# Altium schematic sheet 05021002_GPIO's.SchDoc: Ipê Board
size A4; Organization: Cerebra SC; Address1: R. Coriolano José Gilbertone; Address2: Jd. Paulista; Address3: n° 703; Address4: São Carlos - Brasil; DocumentNumber: 3; Revision: A; SheetNumber: 3; SheetTotal: 8
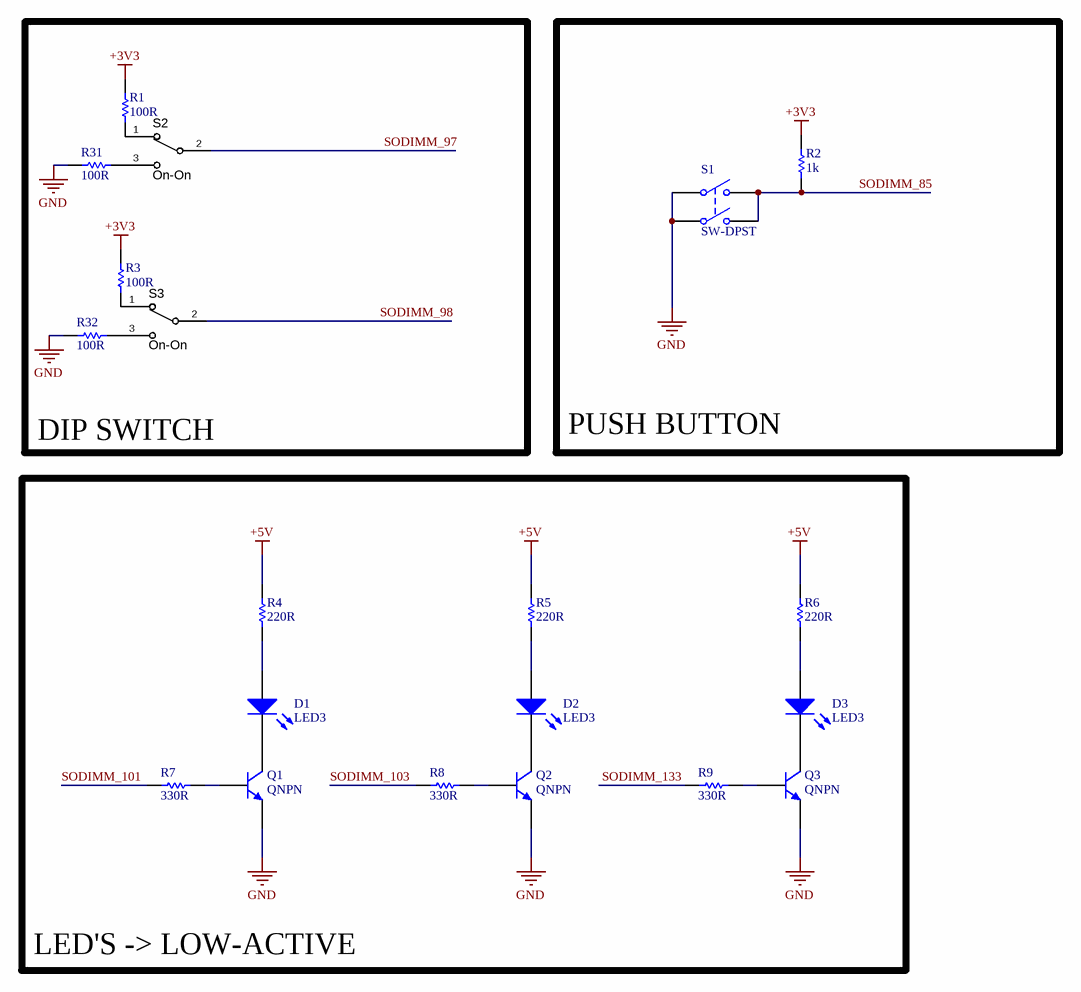
[diagram p0: 05021002_GPIO's.SchDoc]

## Parts
D1  LED3  [LED-0805-K]
D2  LED3  [LED-0805-K]
D3  LED3  [LED-0805-K]
Q1  QNPN  [SOT-23]
Q2  QNPN  [SOT-23]
Q3  QNPN  [SOT-23]
R1  100R  [0805]
R2  1k  [0805]
R3  100R  [0805]
R4  220R  [0805]
R5  220R  [0805]
R6  220R  [0805]
R7  330R  [0805]
R8  330R  [0805]
R9  330R  [0805]
R31  100R  [0805]
R32  100R  [0805]
S1  SW-DPST  [430182080816]
S2  ON-ON  [SWITCH_SPDT_SLIDER]
S3  ON-ON  [SWITCH_SPDT_SLIDER]

## Blocks framed on the sheet
DIP SWITCH: R1 R3 R31 R32 S2 S3
PUSH BUTTON: R2 S1
LED'S -> LOW-ACTIVE: D1-D3 Q1-Q3 R4-R9

## Nets
+3V3: R1.2 R2.2 R3.2
+5V: R4.2 R5.2 R6.2
GND: Q1.3(E) Q2.3(E) Q3.3(E) R31.2 R32.2 S1.1(COMMON1) S1.3(COMMON2)
SODIMM_85: R2.1 S1.2(NO1) S1.4(NO2)
SODIMM_97: S2.2
SODIMM_98: S3.2
SODIMM_101: R7.1
SODIMM_103: R8.1
SODIMM_133: R9.1
NetD1_1: D1.1(A) R4.1
NetD1_2: D1.2(K) Q1.1(C)
NetD2_1: D2.1(A) R5.1
NetD2_2: D2.2(K) Q2.1(C)
NetD3_1: D3.1(A) R6.1
NetD3_2: D3.2(K) Q3.1(C)
NetQ1_2: Q1.2(B) R7.2
NetQ2_2: Q2.2(B) R8.2
NetQ3_2: Q3.2(B) R9.2
NetR1_1: R1.1 S2.1
NetR3_1: R3.1 S3.1
NetR31_1: R31.1 S2.3
NetR32_1: R32.1 S3.3

## Notes on the sheet
- Title
- Size:
- Date:
- A4
- Number:
- Time:
- Revision:
- Sheet
- of
- File:

## Library data of the parts
D1-D3 = LED3: Typical BLUE SiC LED; pin to pad: 1>A 2>K; Part Number 1: LG R971-KN-1; Manufacturer 1: OSRAM Opto Semiconductors Inc.; Published: 8-Jun-2000; LatestRevisionDate: 17-Dec-2003; LatestRevisionNote: PCB Footprint replaced.; DatasheetVersion: 16-Apr-2002; PackageVersion: 16-Apr-2002; PackageReference: 3.5X2.8X1.9; Publisher: Altium Limited; PackageDescription: SM LED; 2 C-Bend Leads; Body 3.5 x 2.8 x 1.9 mm, inc leads (LxWxH typ)
Q1-Q3 = QNPN: NPN Bipolar Transistor; Part Number 1: MMBT2222A-7-F; Manufacturer 1: Diodes Incorporated; Published: 8-Jun-2000; LatestRevisionDate: 29-May-2009; LatestRevisionNote: IPC-7351 Footprint Added.; PackageVersion: Aug-1999; PackageReference: SOT-23B; Publisher: Altium Limited; PackageDescription: 3-Pin SOT-23 Package 0.95 mm Pitch, 2.4 mm Lead Span
R1 R3 R31 R32 = resistor_gen: Part Number 1: RMCF0805JT100R; Manufacturer 1: Stackpole Electronics Inc.; Value: 100R
R2 = resistor_gen: Part Number 1: RC0805JR-071KL; Manufacturer 1: Yageo; Value: 1k
R4-R6 = resistor_gen: Part Number 1: RMCF0805JT220R; Manufacturer 1: Stackpole Electronics Inc.; Value: 220R
R7-R9 = resistor_gen: Part Number 1: RMCF0805JT330R; Manufacturer 1: Stackpole Electronics Inc.; Value: 330R
S1 = SW-DPST: Double-Pole, Single-Throw Switch; Manufacturer 1: Wurth Electronics Inc; Published: 24-Mar-1999; LatestRevisionDate: 17-Jul-2002; LatestRevisionNote: Re-released for DXP Platform.; PackageReference: DPST-4; Publisher: Altium Limited; PackageDescription: Switch; 4 Leads; Part Number 1: 430182080816
S2 S3 = SW_THD_SPDT_On-On: Switch THD vertical toggle SPDT; Manufacturer 1: TE Connectivity; Part Number 1: SLS121PC04; Contact Rating @ Voltage: 0.25A @ 125VAC; SCDType: spec; Circuit: SPDT; Mounting Type: PCB mount; Supplier 1: Digi-Key; Supplier Part Number 1: 450-1598-ND; Switch Function: On-On